# EAGLE design schematic (EAGLE 7.2.0)
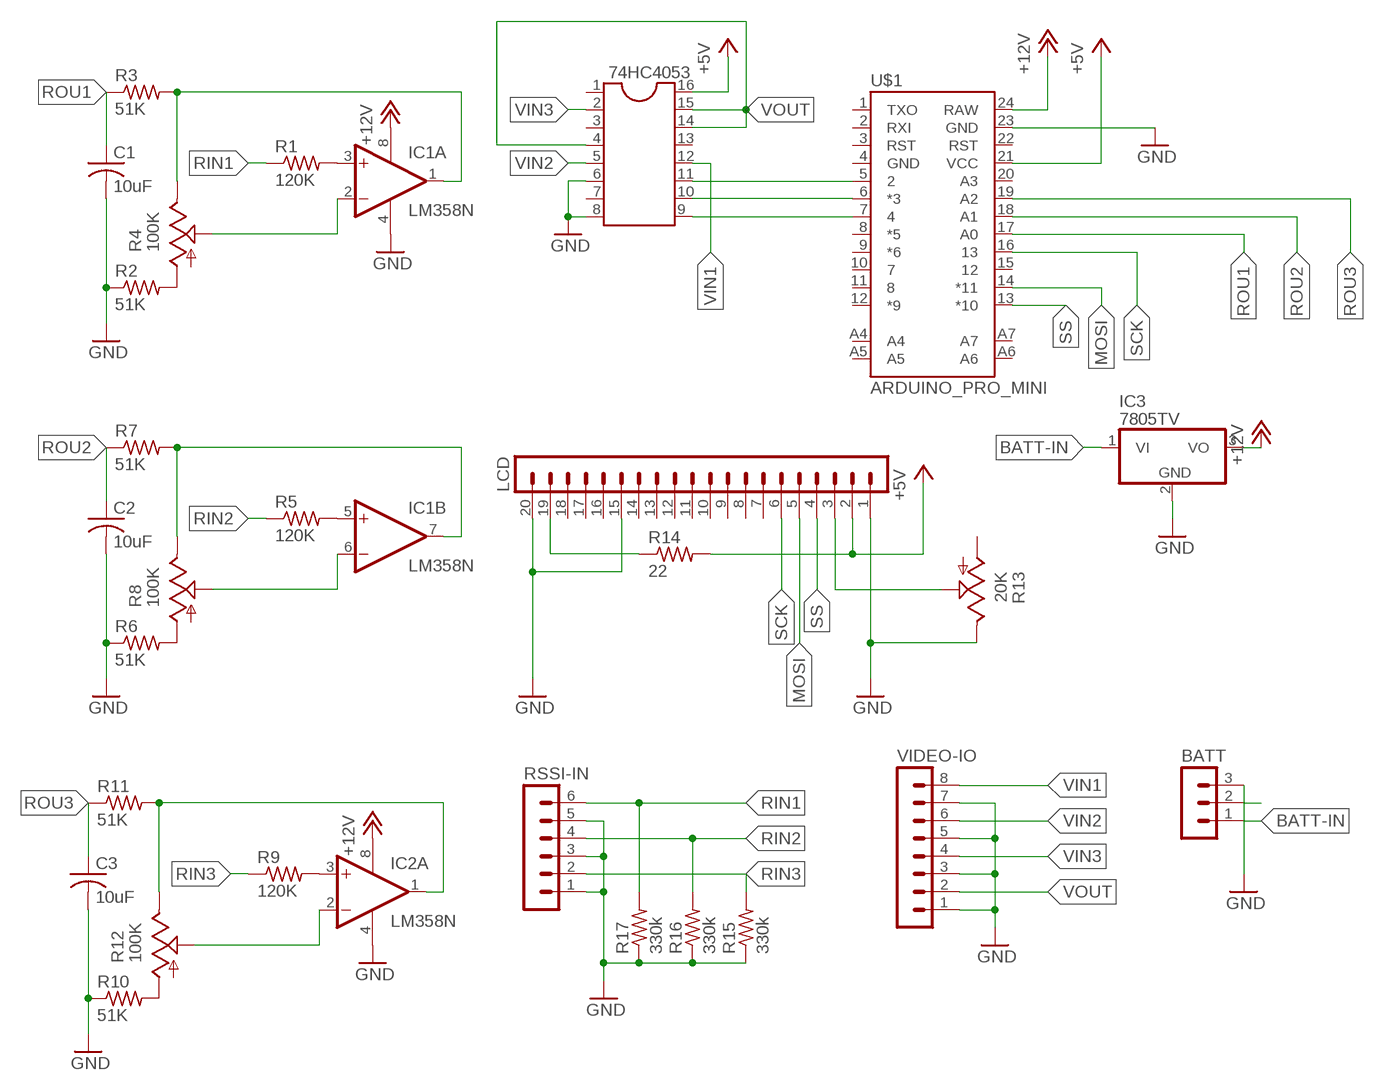
[diagram p0: schematic, sheet 1]

## Parts
74HC4053  DIL16  [DIL16]
BATT  MA03-1  [MA03-1]
C1  10uF  C-US025-025X050  [C025-025X050]
C2  10uF  C-US025-025X050  [C025-025X050]
C3  10uF  C-US025-025X050  [C025-025X050]
IC1  LM358N  [DIL08]
IC2  LM358N  [DIL08]
IC3  7805TV  [TO220V]
LCD  MA20-1L  [MA20-1L]
R1  120K  R-US_0207/10  [0207/10]
R2  51K  R-US_0207/10  [0207/10]
R3  51K  R-US_0207/10  [0207/10]
R4  100K  TRIM_US-S64W  [S64W]
R5  120K  R-US_0207/10  [0207/10]
R6  51K  R-US_0207/10  [0207/10]
R7  51K  R-US_0207/10  [0207/10]
R8  100K  TRIM_US-S64W  [S64W]
R9  120K  R-US_0207/10  [0207/10]
R10  51K  R-US_0207/10  [0207/10]
R11  51K  R-US_0207/10  [0207/10]
R12  100K  TRIM_US-S64W  [S64W]
R13  20K  TRIM_US-S64W  [S64W]
R14  22  R-US_0207/10  [0207/10]
R15  330k  R-US_0207/10  [0207/10]
R16  330k  R-US_0207/10  [0207/10]
R17  330k  R-US_0207/10  [0207/10]
RSSI-IN  MA06-1  [MA06-1]
U$1  ARDUINO_PRO_MINI  [ARDUINO_PRO_MINI]
VIDEO-IO  MA08-1  [MA08-1]

## Nets
+5V: 74HC4053.16 LCD.2 R14.2 U$1.21(VCC)
+12V: IC1.8(P:V+) IC2.8(P:V+) IC3.3(VO) U$1.24(RAW)
BATT-IN: BATT.1 IC3.1(VI)
GND: 74HC4053.6 74HC4053.8 BATT.3 C1.2 C2.2 C3.2 IC1.4(P:V-) IC2.4(P:V-) IC3.2(GND) LCD.1 LCD.15 LCD.20 R2.1 R6.1 R10.1 R13.E R15.1 R16.1 R17.1 RSSI-IN.1 RSSI-IN.3 RSSI-IN.5 U$1.23(GND) VIDEO-IO.1 VIDEO-IO.3 VIDEO-IO.5 VIDEO-IO.7
MOSI: LCD.5 U$1.14(*11)
N$1: 74HC4053.11 U$1.5
N$2: 74HC4053.10 U$1.6(*3)
N$3: 74HC4053.9 U$1.7
N$4: IC1.3(A:+IN) R1.2
N$5: IC1.1(A:OUT) R3.2 R4.E
N$6: IC1.2(A:-IN) R4.S
N$7: R2.2 R4.A
N$9: IC1.7(B:OUT) R7.2 R8.E
N$10: R6.2 R8.A
N$11: IC1.6(B:-IN) R8.S
N$13: IC2.1(A:OUT) R11.2 R12.E
N$14: R10.2 R12.A
N$15: IC2.2(A:-IN) R12.S
N$17: IC1.5(B:+IN) R5.2
N$18: IC2.3(A:+IN) R9.2
N$19: LCD.3 R13.S
N$20: BATT.2
N$22: LCD.19 R14.1
RIN1: R1.1 R17.2 RSSI-IN.6
RIN2: R5.1 R16.2 RSSI-IN.4
RIN3: R9.1 R15.2 RSSI-IN.2
ROU1: C1.1 R3.1 U$1.17(A0)
ROU2: C2.1 R7.1 U$1.18(A1)
ROU3: C3.1 R11.1 U$1.19(A2)
SCK: LCD.6 U$1.16
SS: LCD.4 U$1.13(*10)
VIN1: 74HC4053.12 VIDEO-IO.8
VIN2: 74HC4053.5 VIDEO-IO.6
VIN3: 74HC4053.2 VIDEO-IO.4
VOUT: 74HC4053.4 74HC4053.14 74HC4053.15 VIDEO-IO.2
Unconnected: 74HC4053.1 74HC4053.3 74HC4053.7 74HC4053.13 IC2.5(B:+IN) IC2.6(B:-IN) IC2.7(B:OUT) LCD.7 LCD.8 LCD.9 LCD.10 LCD.11 LCD.12 LCD.13 LCD.14 LCD.16 LCD.17 LCD.18 R13.A U$1.1(TXO) U$1.2(RXI) U$1.3(RST) U$1.4(GND) U$1.8(*5) U$1.9(*6) U$1.10 U$1.11 U$1.12(*9) U$1.15 U$1.20(A3) U$1.22(RST) U$1.A4 U$1.A5 U$1.A6 U$1.A7

## Library data of the parts
74HC4053 = ic-package:DIL16: Dual In Line / Socket
BATT = con-lstb:MA03-1: PIN HEADER; OC_FARNELL: unknown; OC_NEWARK: unknown
C1-C3 = rcl:C-US: CAPACITOR, American symbol
IC1 IC2 = linear:LM358: OP AMP also LM158; LM258; LM2904 Source: http://cache.national.com/ds/LM/LM158.pdf
IC3 = linear:78*: Positive VOLTAGE REGULATOR Source: http://cache.national.com/ds/LM/LM78L05.pdf http://www.fairchildsemi.com/ds/LM/LM7805.pdf
LCD = con-lstb:MA20-1L: PIN HEADER; OC_FARNELL: unknown; OC_NEWARK: unknown
R1-R3 R5-R7 R9-R11 R14-R17 = rcl:R-US_: RESISTOR, American symbol
R4 R8 R12 R13 = pot:TRIM_US-: POTENTIOMETER
RSSI-IN = con-lstb:MA06-1: PIN HEADER; OC_FARNELL: unknown; OC_NEWARK: unknown
U$1 = SparkFun-Boards:ARDUINO_PRO_MINI
VIDEO-IO = con-lstb:MA08-1: PIN HEADER; OC_FARNELL: unknown; OC_NEWARK: unknown

## Board
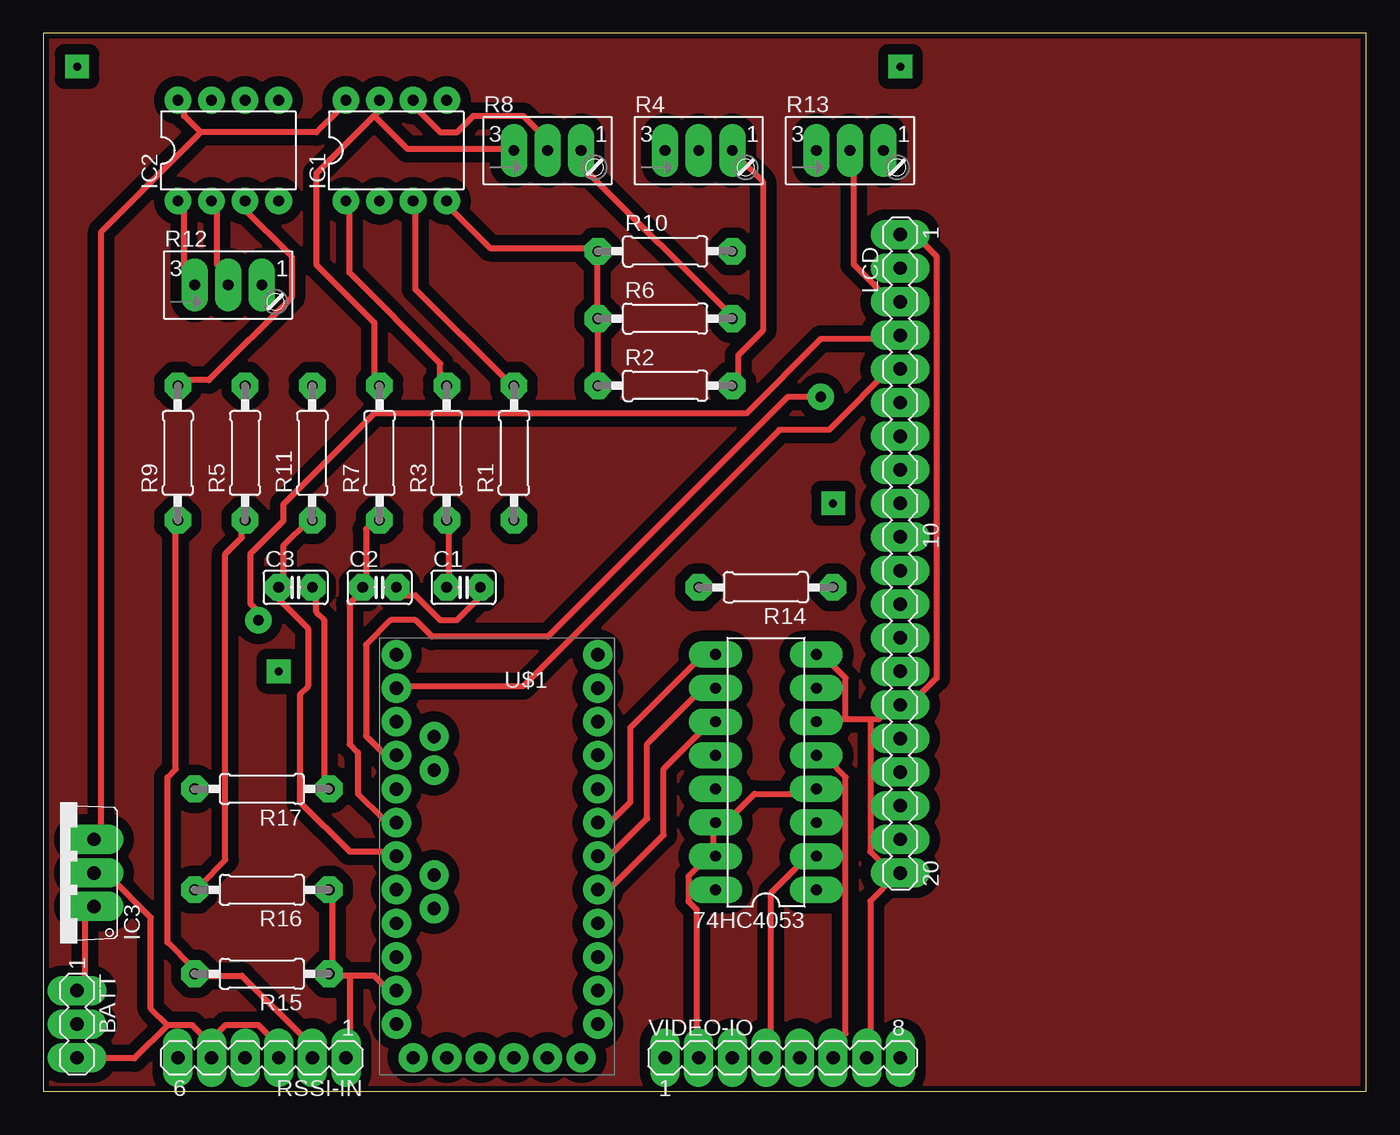
[diagram p1: board, top side]
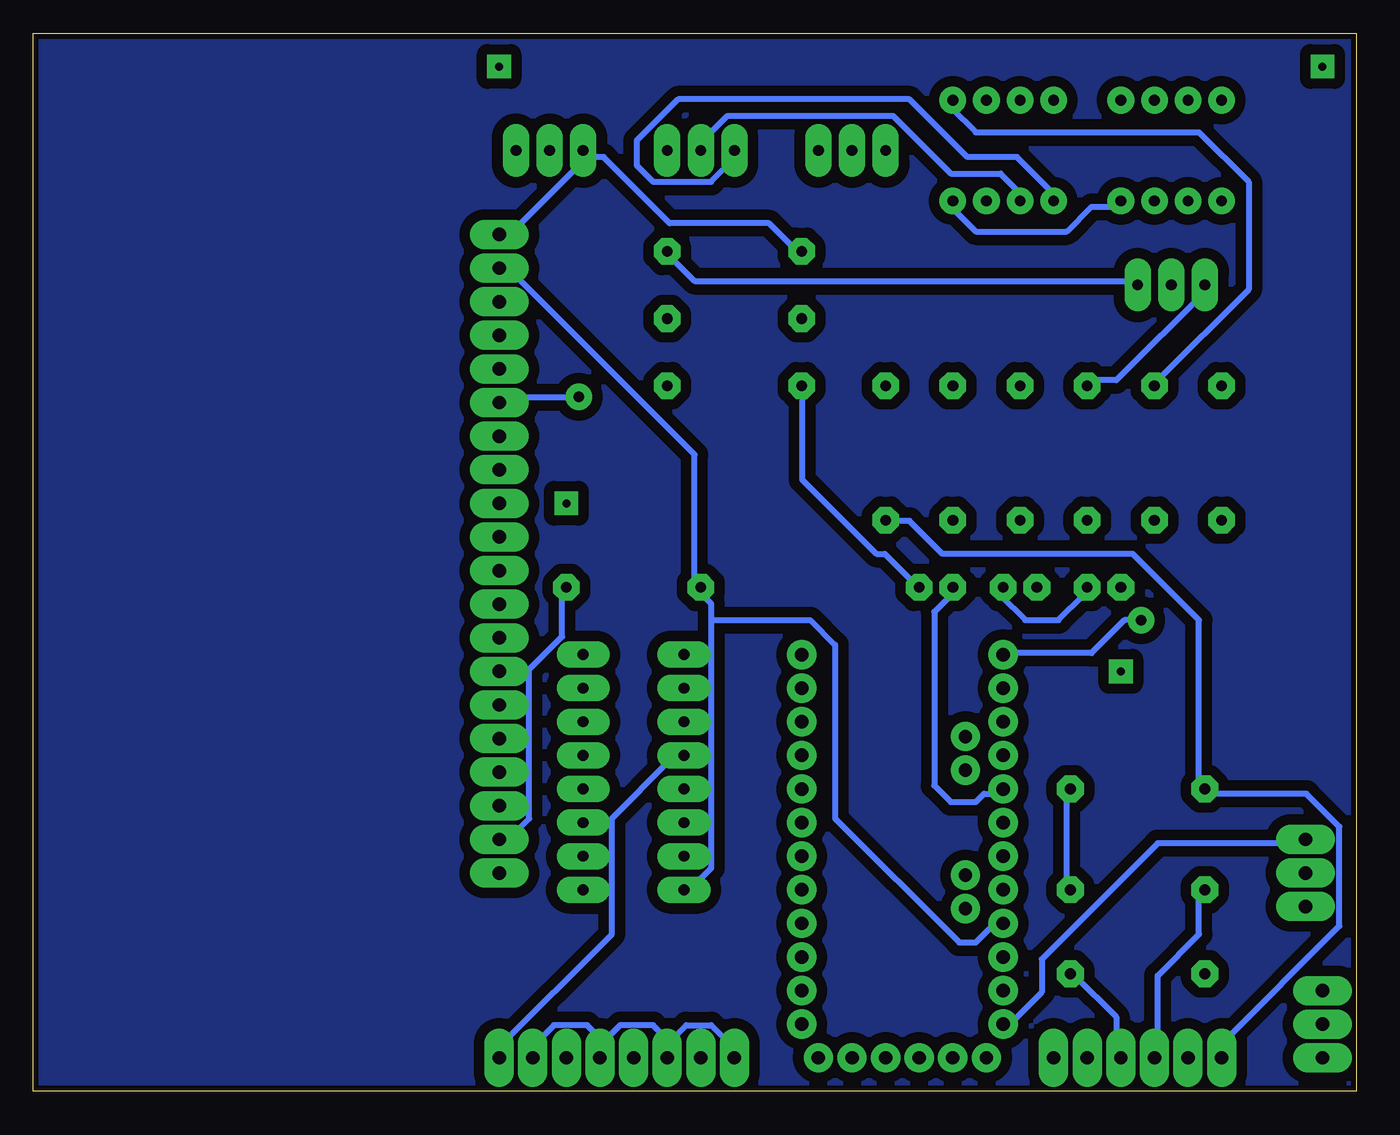
[diagram p2: board, bottom side, seen from below]

Size 100 x 80 mm. Coordinates in mm from the lower left corner, seen from the top.
Outline: 0,0 100,0 100,80 0,80 0,0
Copper layers (1*16): Top 0.035mm / dielectric 1.5mm / Bottom 0.035mm
Design rules "FJ043CWRTMEP27Y3QS *": minimum track width 0.45mm, minimum drill 0.8mm, track to track 0.8mm, track to pad 0.8mm, pad to pad 0.45mm, via to via 0.8mm, smd to smd 8mil, copper to edge 10mil, drill to drill 8mil, minimum pad ring 0.6mm, minimum via ring 0.6mm, stop-mask expansion 0mil, vias tented up to drill 0mil, thermal gap 10mil

### Footprints (pad centres in the part's own frame; a part is rotated, then mirrored left to right if it is on the bottom)
DIL16 = drill 0.813 long: 1 -8.89,-3.81; 2 -6.35,-3.81; 3 -3.81,-3.81; 4 -1.27,-3.81; 5 1.27,-3.81; 6 3.81,-3.81; 7 6.35,-3.81; 8 8.89,-3.81; 9 8.89,3.81; 10 6.35,3.81; 11 3.81,3.81; 12 1.27,3.81; 13 -1.27,3.81; 14 -3.81,3.81; 15 -6.35,3.81; 16 -8.89,3.81
MA03-1 = drill 1.016 long: 1 -2.54,0; 2 0,0; 3 2.54,0
C025-025X050 = drill 0.813 octagon: 1 -1.27,0; 2 1.27,0
DIL08 = drill 0.813 pad 1.27: 1 -3.81,-3.81; 2 -1.27,-3.81; 3 1.27,-3.81; 4 3.81,-3.81; 5 3.81,3.81; 6 1.27,3.81; 7 -1.27,3.81; 8 -3.81,3.81
TO220V = drill 1.016 long: 1 -2.54,-2.54; 2 0,-2.54; 3 2.54,-2.54
MA20-1L = drill 1.016 long: 1 24.13,0; 2 21.59,0; 3 19.05,0; 4 16.51,0; 5 13.97,0; 6 11.43,0; 7 8.89,0; 8 6.35,0; 9 3.81,0; 10 1.27,0; 11 -1.27,0; 12 -3.81,0; 13 -6.35,0; 14 -8.89,0; 15 -11.43,0; 16 -13.97,0; 17 -16.51,0; 18 -19.05,0; 19 -21.59,0; 20 -24.13,0
0207/10 = drill 0.813 octagon: 1 -5.08,0; 2 5.08,0
S64W = drill 0.813 long: A 2.54,1.27; E -2.54,1.27; S 0,1.27
MA06-1 = drill 1.016 long: 1 -6.35,0; 2 -3.81,0; 3 -1.27,0; 4 1.27,0; 5 3.81,0; 6 6.35,0
ARDUINO_PRO_MINI = drill 1.016 pad 1.88: 1 -7.62,12.7; 2 -7.62,10.16; 3 -7.62,7.62; 4 -7.62,5.08; 5 -7.62,2.54; 6 -7.62,0; 7 -7.62,-2.54; 8 -7.62,-5.08; 9 -7.62,-7.62; 10 -7.62,-10.16; 11 -7.62,-12.7; 12 -7.62,-15.24; 13 7.62,-15.24; 14 7.62,-12.7; 15 7.62,-10.16; 16 7.62,-7.62; 17 7.62,-5.08; 18 7.62,-2.54; 19 7.62,0; 20 7.62,2.54; 21 7.62,5.08; 22 7.62,7.62; 23 7.62,10.16; 24 7.62,12.7; A4 4.763,1.429; A5 4.763,3.969; A6 4.763,-9.049; A7 4.763,-6.509; BLK -6.35,15.24; GND -3.81,15.24; GRN 6.35,15.24; RXI 1.27,15.24; TXO 3.81,15.24; VCC -1.27,15.24
MA08-1 = drill 1.016 long: 1 -8.89,0; 2 -6.35,0; 3 -3.81,0; 4 -1.27,0; 5 1.27,0; 6 3.81,0; 7 6.35,0; 8 8.89,0

### Placement (x,y rotation side)
74HC4053  54.61,24.13 90 top
BATT  2.54,5.08 270 top
C1  31.75,38.1 0 top
C2  25.4,38.1 0 top
C3  19.05,38.1 0 top
IC1  26.67,71.12 0 top
IC2  13.97,71.12 0 top
IC3  1.27,16.51 90 top
LCD  64.77,40.64 90 top
R1  35.56,48.26 90 top
R2  46.99,53.34 0 top
R3  30.48,48.26 90 top
R4  49.53,69.85 0 top
R5  15.24,48.26 90 top
R6  46.99,58.42 0 top
R7  25.4,48.26 90 top
R8  38.1,69.85 0 top
R9  10.16,48.26 90 top
R10  46.99,63.5 0 top
R11  20.32,48.26 90 top
R12  13.97,59.69 0 top
R13  60.96,69.85 0 top
R14  54.61,38.1 180 top
R15  16.51,8.89 180 top
R16  16.51,15.24 180 top
R17  16.51,22.86 180 top
RSSI-IN  16.51,2.54 180 top
U$1  34.29,17.78 180 top
VIDEO-IO  55.88,2.54 0 top

### Tracks (layer width: path | path; a pad name or v marks a point on that pad's centre or on a via)
+5V
  Bottom 0.45: 48.75,35.62 48.75,36.88 49.38,37.5 R14.2 50,38.12 50,48.12 63.75,61.88 64.38,61.88 LCD.2 | 48.75,35.62 48.75,16.88 50,15.62 50.62,15.62 74HC4053.16 | 48.75,35.62 41.25,35.62 39.38,33.75 39.38,20.62 30,11.25 28.75,11.25 27.5,12.5 26.88,12.5 U$1.21
+12V
  Top 0.45: 11.88,72.5 10.62,73.75 10.62,74.38 IC2.8 | 11.88,72.5 20.62,72.5 22.5,74.38 IC1.8 | 11.88,72.5 4.38,65 4.38,19.38 IC3.3
  Bottom 0.45: U$1.24 26.25,5 23.75,7.5 23.75,10 15,18.75 4.38,18.75 IC3.3
ASD
  pour Bottom (isolate 0.406): 0,80.01 100.33,80.01 100.33,0 0,0
BATT-IN
  Top 0.45: BATT.1 3.12,8.12 3.12,13.12 3.75,13.75 IC3.1
GND
  Top 0.45: 9.38,5 6.88,2.5 3.12,2.5 BATT.3 | 9.38,5 11.25,5 12.5,3.75 | 12.5,3.75 12.5,3.12 RSSI-IN.5 | 9.38,5 8.12,6.25 8.12,13.12 5,16.25 4.38,16.25 IC3.2 | C1.2 33.12,37.5 31.25,35.62 30,35.62 28.12,37.5 26.88,37.5 C2.2 | 23.12,8.75 25,8.75 26.25,7.5 U$1.23 | 23.12,8.75 21.88,8.75 R15.1 21.88,9.38 21.88,15 R16.1 | 23.12,8.75 23.12,3.12 RSSI-IN.1 | C3.2 20.62,37.5 20.62,36.25 21.25,35.62 21.25,23.12 R17.1 | 12.5,3.75 13.75,5 16.25,5 18.12,3.12 RSSI-IN.3 | 62.5,28.12 63.12,28.12 64.38,29.38 LCD.15 65,29.38 65.62,29.38 67.5,31.25 67.5,63.12 66.25,64.38 65,64.38 LCD.1 | 62.5,28.12 60.62,28.12 | 60.62,28.12 58.75,28.12 74HC4053.6 | 60.62,28.12 60.62,31.25 58.75,33.12 74HC4053.8 | 62.5,28.12 62.5,18.12 63.75,16.88 64.38,16.88 LCD.20 64.38,16.25 62.5,14.38 62.5,3.12 VIDEO-IO.7 | R2.1 41.88,53.75 41.88,58.12 R6.1 41.88,58.75 41.88,63.12 R10.1 41.88,63.75 33.75,63.75 30.62,66.88 IC1.4
  Bottom 0.45: C3.2 20.62,37.5 22.5,35.62 25,35.62 26.88,37.5 C2.2 | R17.1 21.88,22.5 21.88,15.62 R16.1 | RSSI-IN.3 18.12,3.12 18.12,5.62 21.25,8.75 R15.1 | 51.88,3.75 50.62,5 48.75,5 46.88,3.12 VIDEO-IO.1 | 51.88,3.75 51.88,3.12 VIDEO-IO.3 | 56.88,3.75 56.88,3.12 VIDEO-IO.5 | 56.88,3.75 55.62,5 53.12,5 51.88,3.75 | 56.88,3.75 58.12,5 60.62,5 61.88,3.75 61.88,3.12 VIDEO-IO.7 | LCD.1 64.38,64.38 58.75,70 58.75,70.62 R13.E 58.12,70.62 56.88,70.62 51.88,65.62 44.38,65.62 42.5,63.75 R10.1 | IC2.4 18.12,66.88 20,66.88 21.88,65 28.75,65 30.62,66.88 IC1.4 | C1.2 33.12,38.12 35.62,40.62 36.25,40.62 41.88,46.25 41.88,53.12 R2.1
MOSI
  Top 0.45: U$1.14 26.88,30.62 36.25,30.62 55.62,50 59.38,50 64.38,55 LCD.5
N$1
  Top 0.45: 74HC4053.11 50.62,27.5 50,27.5 46.88,24.38 46.88,19.38 42.5,15 U$1.5
N$2
  Top 0.45: 74HC4053.10 50.62,30 49.38,30 45.62,26.25 45.62,20.62 42.5,17.5 U$1.6
N$3
  Top 0.45: 74HC4053.9 50.62,33.12 50,33.12 44.38,27.5 44.38,21.88 42.5,20 U$1.7
N$4
  Top 0.45: IC1.3 28.12,66.88 28.12,60.62 35,53.75 R1.2
N$5
  Top 0.45: IC1.1 23.12,66.88 23.12,61.88 30,55 30,53.75 R3.2
  Bottom 0.45: R4.E 46.88,70.62 48.75,68.75 53.12,68.75 54.38,70 54.38,71.88 51.25,75 33.75,75 29.38,70.62 25.62,70.62 22.5,67.5 IC1.1
N$6
  Bottom 0.45: IC1.2 25.62,67.5 25.62,68.12 26.88,69.38 30.62,69.38 35,73.75 47.5,73.75 50,71.25 R4.S
N$7
  Top 0.45: R2.2 52.5,53.75 52.5,55.62 54.38,57.5 54.38,68.75 52.5,70.62 R4.A
N$8
  pour Top (isolate 0.406): 0,80.01 100.33,80.01 100.33,0 0,0
N$9
  Top 0.45: 25,73.75 25.62,74.38 IC1.7 | 25,73.75 20.62,69.38 20.62,62.5 25,58.12 25,53.75 R7.2 | 25,73.75 27.5,71.25 35,71.25 R8.E
N$10
  Top 0.45: R8.A 41.25,70.62 41.25,69.38 51.88,58.75 R6.2
N$11
  Top 0.45: R8.S 38.12,71.25 38.12,71.88 36.25,73.75 32.5,73.75 31.25,72.5 30,72.5 28.12,74.38 IC1.6
N$12  (via drill 0.6)
  other vias: 2.54,77.47
N$13
  Top 0.45: IC2.1 10.62,66.88 10.62,61.88 11.25,61.25 R12.E
  Bottom 0.45: R11.2 20,53.75 18.12,53.75 11.25,60.62 R12.E
N$14
  Bottom 0.45: R12.A 16.88,61.25 50,61.25 51.88,63.12 R10.2
N$15
  Top 0.45: IC2.2 13.12,66.88 13.12,62.5 14.38,61.25 R12.S
N$16  (via drill 0.6)
  other vias: 17.78,31.75
N$17
  Bottom 0.45: R5.2 15,53.75 8.12,60.62 8.12,68.75 11.88,72.5 28.75,72.5 30.62,74.38 IC1.5
N$18
  Top 0.45: R9.2 10.62,53.75 12.5,53.75 18.75,60 18.75,63.12 15,66.88 IC2.3
N$19
  Top 0.45: R13.S 61.25,70.62 61.25,62.5 64.38,59.38 LCD.3
N$21  (via drill 0.6)
  other vias: 59.69,44.45
N$22
  Bottom 0.45: R14.1 60,37.5 60,34.38 62.5,31.88 62.5,20.62 64.38,18.75 LCD.19
N$23  (via drill 0.6)
  other vias: 64.77,77.47
RIN1
  Bottom 0.45: RSSI-IN.6 10,3.12 10,3.75 1.25,12.5 1.25,20 3.75,22.5 11.25,22.5 R17.2 11.88,23.12 11.88,35.62 16.88,40.62 31.25,40.62 33.75,43.12 35,43.12 R1.1
RIN2
  Top 0.45: R5.1 15,43.12 15,41.88 13.75,40.62 13.75,17.5 11.88,15.62 R16.2
  Bottom 0.45: R16.2 11.88,15 11.88,11.88 15,8.75 15,3.12 RSSI-IN.4
RIN3
  Top 0.45: R9.1 10,43.12 10,24.38 9.38,23.75 9.38,11.25 11.25,9.38 R15.2 11.88,8.75 15,8.75 20,3.75 20,3.12 RSSI-IN.2
ROU1
  Top 0.45: C1.1 30.62,38.12 30.62,43.12 R3.1
  Bottom 0.45: U$1.17 26.88,22.5 28.12,22.5 28.75,21.88 30.62,21.88 31.88,23.12 31.88,36.25 30.62,37.5 C1.1
ROU2
  Top 0.45: R7.1 25,43.12 24.38,42.5 24.38,38.12 C2.1 23.75,37.5 23.12,36.88 23.12,26.25 23.75,25.62 23.75,22.5 25.62,20.62 26.25,20.62 U$1.18
ROU3
  Top 0.45: R11.1 20,43.12 18.12,41.25 18.12,38.12 C3.1 17.5,37.5 20,35 20,30.62 19.38,30 19.38,21.88 23.12,18.12 26.25,18.12 U$1.19
SCK  (via drill 0.8)
  Top 0.45: v58.75,52.5 56.25,52.5 38.12,34.38 29.38,34.38 28.12,35.62 26.25,35.62 24.38,33.75 24.38,26.88 25.62,25.62 26.25,25.62 U$1.16
  Bottom 0.45: v58.75,52.5 63.75,52.5 64.38,51.88 LCD.6
SS  (via drill 0.8)
  Top 0.45: v16.25,35.62 16.25,36.25 15.62,36.88 15.62,40.62 18.12,43.12 18.12,44.38 25,51.25 53.12,51.25 58.75,56.88 64.38,56.88 LCD.4
  Bottom 0.45: v16.25,35.62 17.5,35.62 20,33.12 26.25,33.12 U$1.13
VIN1
  Bottom 0.45: 74HC4053.12 51.25,25 51.88,25 56.25,20.62 56.25,11.88 65,3.12 VIDEO-IO.8
VIN2
  Top 0.45: 74HC4053.5 58.75,25 59.38,25 60.62,23.75 60.62,4.38 59.38,3.12 VIDEO-IO.6
VIN3
  Top 0.45: 74HC4053.2 58.12,17.5 57.5,17.5 55,15 55,3.12 VIDEO-IO.4
VOUT
  Top 0.45: 50.62,18.12 50.62,20 74HC4053.14 51.25,20 53.75,22.5 58.12,22.5 74HC4053.4 | 50.62,18.12 48.75,16.25 48.75,14.38 49.38,13.75 49.38,3.12 VIDEO-IO.2 | 50.62,18.12 74HC4053.15